# Altium project sonar.PrjPcb
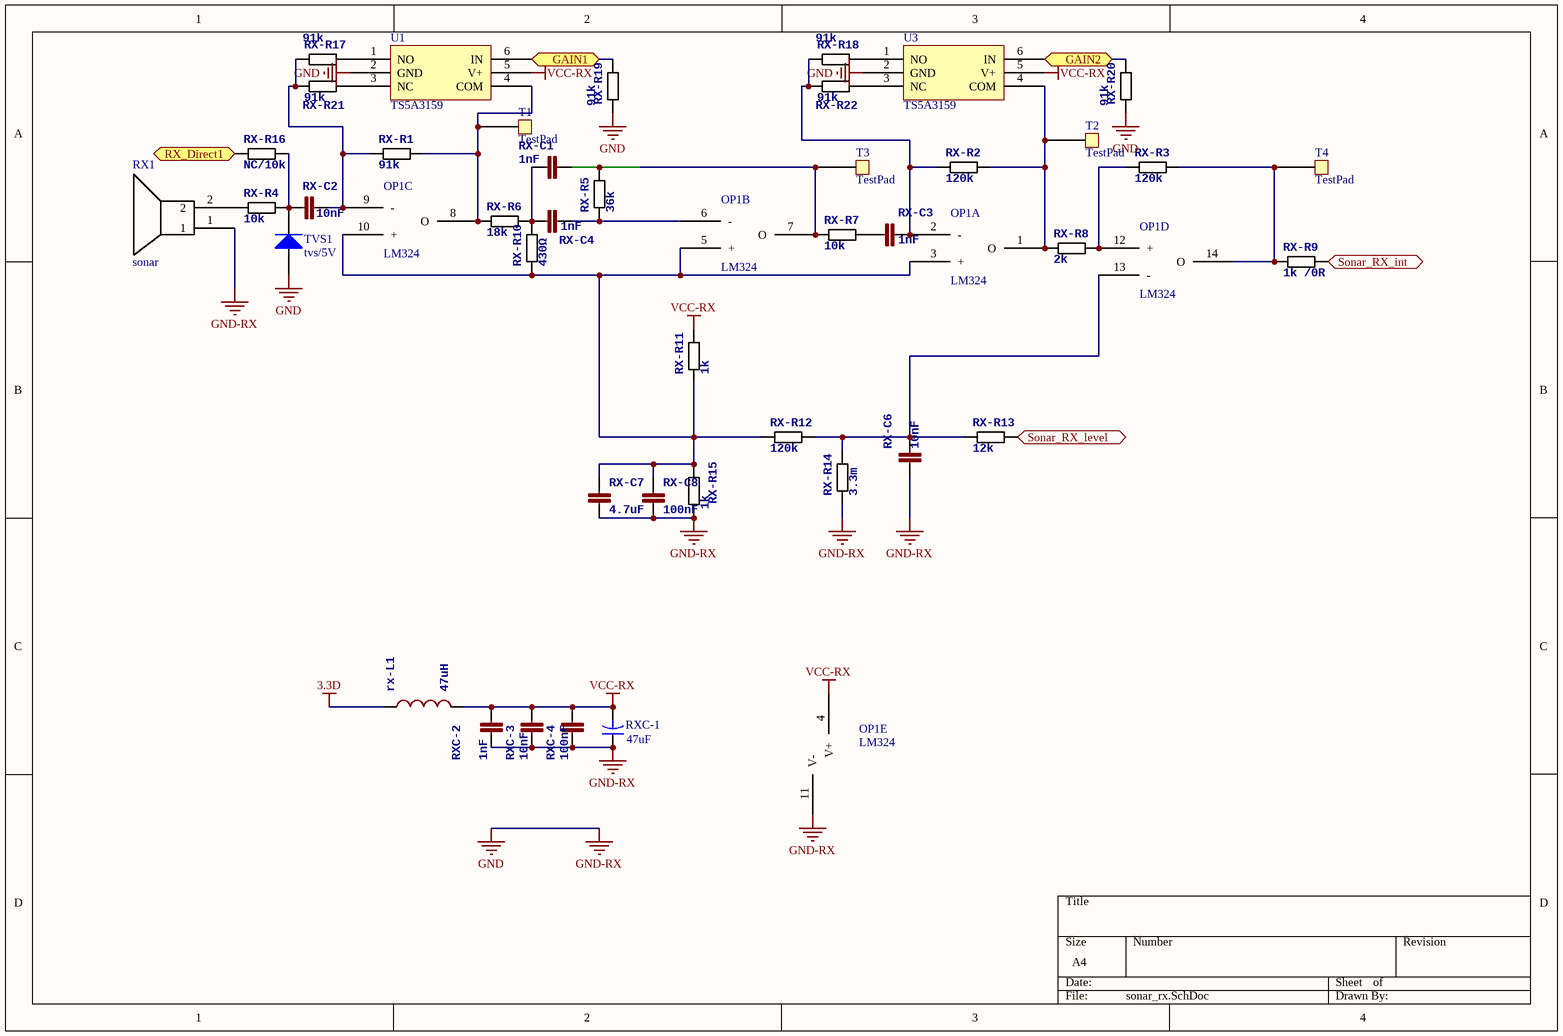
[diagram p0: sonar_rx.SchDoc]
3 sheets, 83 parts. Net scope: flat (ports and power ports of the same name join across sheets).
Board file: sonar_test.PcbDoc
Sheets:
  sonar_rx.SchDoc
  MCU.SchDoc
  sonar_tx.SchDoc

## Sheet sonar_rx.SchDoc
size A4

### Parts
OP1  LM324  (parts A,B,C,D,E of 5)
RX1  sonar  [sonar-16mm]
RX-C1  1nF  [0402]
RX-C2  10nF  [0402]
RX-C3  1nF  [0402]
RX-C4  1nF  [0402]
RX-C6  10nF  [0402]
RX-C7  4.7uF  [0402]
RX-C8  100nF  [0402]
rx-L1  47uH  [0805-IND]
RX-R1  91k  [0402]
RX-R2  120k  [0402]
RX-R3  120k  [0402]
RX-R4  10k  [0402]
RX-R5  36k  [0402]
RX-R6  18k  [0402]
RX-R7  10k  [0402]
RX-R8  2k  [0402]
RX-R9  1k /0R  [0402]
RX-R10  430Ω  [0402]
RX-R11  1k  [0402]
RX-R12  120k  [0402]
RX-R13  12k  [0402]
RX-R14  3.3m  [0402]
RX-R15  1k  [0402]
RX-R16  NC/10k  [0402]
RX-R17  91k  [0402]
RX-R18  91k  [0402]
RX-R19  91k  [0402]
RX-R20  91k  [0402]
RX-R21  91k  [0402]
RX-R22  91k  [0402]
RXC-1  47uF  [C0805]
RXC-2  1nF  [0402]
RXC-3  10nF  [0402]
RXC-4  100nF  [0402]
T1  TestPad  [TestPad - 1mm]
T2  TestPad  [TestPad - 1mm]
T3  TestPad  [TestPad - 1mm]
T4  TestPad  [TestPad - 1mm]
TVS1  tvs/5V  [0805]
U1  TS5A3159  [SOT23-6]
U3  TS5A3159  [SOT23-6]

### Ports
GAIN1, GAIN2, RX_Direct1, Sonar_RX_int, Sonar_RX_level

### Nets
3.3D: rx-L1.1
GND: OP1.11(V-) RX1.1 RX-C6.1 RX-C7.2 RX-C8.2 RX-R14.1 RX-R15.1 RX-R19.1 RX-R20.1 RXC-1.1 RXC-2.1 RXC-3.1 RXC-4.1 TVS1.1(A) U1.2(GND) U3.2(GND)  [also labelled GND-RX]
VCC-RX: OP1.4(V+) rx-L1.2 RX-R11.2 RXC-1.2 RXC-2.2 RXC-3.2 RXC-4.2 U1.5(V+) U3.5(V+)
NetC7_1: RX-R16.1 ; port RX_Direct1
Netmcu1_7: RX-R9.2 ; port Sonar_RX_int
Netmcu1_8: RX-R13.2 ; port Sonar_RX_level
Netmcu1_23: RX-R19.2 U1.6(IN) ; port GAIN1
Netmcu1_24: RX-R20.2 U3.6(IN) ; port GAIN2
NetOP1_1: OP1.1(O) RX-R2.2 RX-R8.1 T2.1 U3.4(COM)
NetOP1_2: OP1.2(-) RX-C3.2 RX-R2.1 RX-R18.1 RX-R22.1
NetOP1_3: OP1.3(+) OP1.5(+) OP1.10(+) RX-C7.1 RX-C8.1 RX-R10.1 RX-R11.1 RX-R12.1 RX-R15.2
NetOP1_6: OP1.6(-) RX-C4.2 RX-R5.1
NetOP1_7: OP1.7(O) RX-C1.2 RX-R5.2 RX-R7.1 T3.1
NetOP1_8: OP1.8(O) RX-R1.2 RX-R6.1 T1.1 U1.4(COM)
NetOP1_9: OP1.9(-) RX-C2.2 RX-R1.1 RX-R17.1 RX-R21.1
NetOP1_12: OP1.12(+) RX-R3.1 RX-R8.2
NetOP1_13: OP1.13(-) RX-C6.2 RX-R12.2 RX-R13.1 RX-R14.2
NetOP1_14: OP1.14(O) RX-R3.2 RX-R9.1 T4.1
NetRX1_2: RX1.2 RX-R4.1
NetRX-C1_1: RX-C1.1 RX-C4.1 RX-R6.2 RX-R10.2
NetRX-C2_1: RX-C2.1 RX-R4.2 RX-R16.2 TVS1.2(K)
NetRX-C3_1: RX-C3.1 RX-R7.2
NetRX-R17_2: RX-R17.2 U1.1(NO)
NetRX-R18_2: RX-R18.2 U3.1(NO)
NetRX-R21_2: RX-R21.2 U1.3(NC)
NetRX-R22_2: RX-R22.2 U3.3(NC)

### Library data of the parts
OP1 = OP-SOP14
RX-C1-RX-C4 RX-C6 RXC-2-RXC-4 = CAP0603H: <b>Capacitor</b> / Standard 0603 ceramic capacitor, and 0.1" leaded capacitor.; PARTNO: CC0603ZRY5V7BB105
RX-C7 RX-C8 = CAP0603: <b>Capacitor</b> / Standard 0603 ceramic capacitor, and 0.1" leaded capacitor.; PARTNO: CC0603ZRY5V7BB105
rx-L1 = INDUCTOR0805: <b>Inductors</b> / Basic Inductor/Choke - 0603 and 1210. Footprints are not proven and vary greatly between part numbers. / SRR1210: Bourns SRR1210 parts, e.g. SRR1210-100M; PARTNO: MLZ2012M470W
RX-R1-RX-R22 = RESISTOR0603B: <b>Resistor</b> / Basic schematic elements and footprints for 0603, 1206, and PTH 1/10th watt (small) resistors.; PARTNO: RMCF0402FT453K
RXC-1 = Cap2: Capacitor; Published: 23-Sep-2002; PackageReference: CAPR5-4X5; Publisher: Altium Limited; PackageDescription: Capacitor; 2 Leads; Value: 47uF
TVS1 = Diode: Default Diode; Published: 8-Jun-2000; LatestRevisionDate: 17-Jul-2002; LatestRevisionNote: Re-released for DXP Platform.; PackageVersion: Sep-1996; PackageReference: SMC; Publisher: Altium Limited; PackageDescription: DO-214-AB/SMC; 2 C-Bend Leads; Body 7.9 x 5.9 mm, inc. leads (LxW); Code_JEDEC: DO-214-AB

## Sheet MCU.SchDoc
size A4
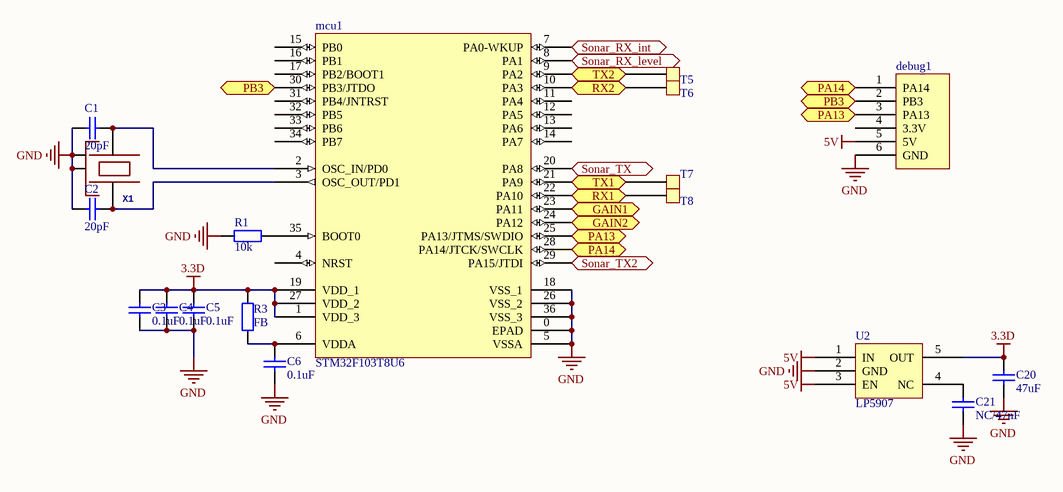
[diagram p1: MCU.SchDoc]

### Parts
C1  value 20pF  [0402]  (hidden comment: Cap)
C2  value 20pF  [0402]  (hidden comment: Cap)
C3  value 0.1uF  [0402]  (hidden comment: Cap)
C4  value 0.1uF  [0402]  (hidden comment: Cap)
C5  value 0.1uF  [0402]  (hidden comment: Cap)
C6  value 0.1uF  [0402]  (hidden comment: Cap)
C20  value 47uF  [0805]  (hidden comment: Cap)
C21  value NC/47nF  [0402]  (hidden comment: Cap)
debug1  debug  [WFRSM125]  (value not drawn)
mcu1  STM32F103T8U6  [VFQN36_N]
R1  value 10k  [0402]  (hidden comment: Res2)
R3  value FB  [0402]  (hidden comment: Res2)
T5  TestPad  [TestPad - 1mm]  (value not drawn)
T6  TestPad  [TestPad - 1mm]  (value not drawn)
T7  TestPad  [TestPad - 1mm]  (value not drawn)
T8  TestPad  [TestPad - 1mm]  (value not drawn)
U2  LP5907  [SOT23-5]
X1  24.000 KHz 3.2x2.5mm 8-10pf  [OSCILLATOR-3.2X2.5]  (value not drawn)

### Ports
GAIN1, GAIN2, PA13, PA14, PB3, RX1, RX2, Sonar_RX_int, Sonar_RX_level, Sonar_TX, Sonar_TX2, TX1, TX2

### Nets
3.3D: C3.2 C4.2 C5.2 C20.1 mcu1.1(VDD_3) mcu1.19(VDD_1) mcu1.27(VDD_2) R3.1 U2.5(OUT)
5V: debug1.5(5V) U2.1(IN) U2.3(EN)
GND: C1.1 C2.1 C3.1 C4.1 C5.1 C6.1 C20.2 C21.2 debug1.6(GND) mcu1.0(EPAD) mcu1.5(VSSA) mcu1.18(VSS_1) mcu1.26(VSS_2) mcu1.36(VSS_3) R1.2 U2.2(GND) X1.2(NC_2) X1.4(NC_4)
NetC1_2: C1.2 mcu1.2(OSC_IN/PD0) X1.1
NetC2_2: C2.2 mcu1.3(OSC_OUT/PD1) X1.3
NetC6_2: C6.2 mcu1.6(VDDA) R3.2
NetC21_1: C21.1 U2.4(NC)
Netdebug1_1: debug1.1(PA14) mcu1.28(PA14/JTCK/SWCLK) ; port PA14
Netdebug1_2: debug1.2(PB3) mcu1.30(PB3/JTDO) ; port PB3
Netdebug1_3: debug1.3(PA13) mcu1.25(PA13/JTMS/SWDIO) ; port PA13
Netmcu1_7: mcu1.7(PA0-WKUP) ; port Sonar_RX_int
Netmcu1_8: mcu1.8(PA1) ; port Sonar_RX_level
Netmcu1_9: mcu1.9(PA2) T5.1 ; port TX2
Netmcu1_10: mcu1.10(PA3) T6.1 ; port RX2
Netmcu1_20: mcu1.20(PA8) ; port Sonar_TX
Netmcu1_21: mcu1.21(PA9) T7.1 ; port TX1
Netmcu1_22: mcu1.22(PA10) T8.1 ; port RX1
Netmcu1_23: mcu1.23(PA11) ; port GAIN1
Netmcu1_24: mcu1.24(PA12) ; port GAIN2
Netmcu1_29: mcu1.29(PA15/JTDI) ; port Sonar_TX2
Netmcu1_35: mcu1.35(BOOT0) R1.1

Not connected (* = marked no-connect by the designer): debug1 4(3.3V); mcu1 4(NRST) 11(PA4) 12(PA5) 13(PA6) 14(PA7) 15(PB0) 16(PB1) 17(PB2/BOOT1) 31(PB4/JNTRST) 32(PB5) 33(PB6) 34(PB7)

### Library data of the parts
C1-C6 C20 C21 = Cap: Capacitor; Published: 8-Jun-2000; LatestRevisionDate: 17-Jul-2002; LatestRevisionNote: Re-released for DXP Platform.; PackageReference: RAD-0.3; Publisher: Altium Limited; PackageDescription: Radial Cap, Thru-Hole; 2 Leads; 0.3 in Pin Spacing
mcu1 = STM32F103T8U6: STM32 ARM-based 32-bit MCU with 64 Kbytes Flash, 36-pin VFQFPN, Industrial Temperature; Published: *; DatasheetVersion: *; PackageVersion: *; PackageReference: *; Publisher: *; PackageDescription: *; ComponentLink1Description: *; ComponentLink1URL: *; ComponentLink2Description: *; ComponentLink2URL: *
R1 R3 = Res2: Resistor; Published: 8-Jun-2000; LatestRevisionDate: 17-Jul-2002; LatestRevisionNote: Re-released for DXP Platform.; PackageReference: AXIAL-0.4; Publisher: Altium Limited; PackageDescription: Axial Device, Thru-Hole; 2 Leads; 0.4 in Pin Spacing
X1 = OSCILLATOR-3.2X2.5: Crystal Oscillator in 3.2x2.5 SMD

## Sheet sonar_tx.SchDoc
size A4
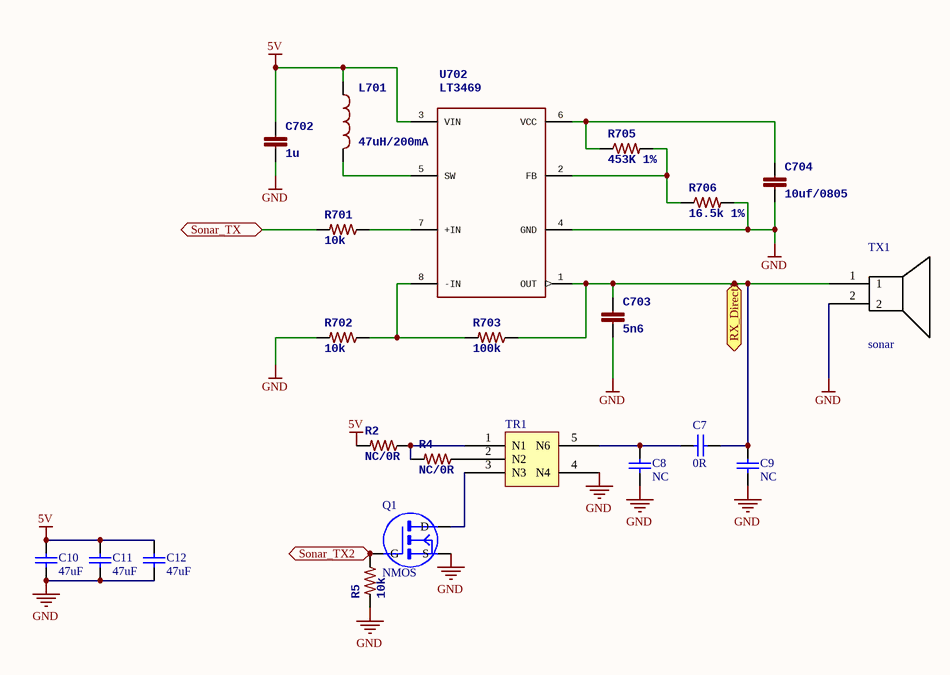
[diagram p2: sonar_tx.SchDoc]

### Parts
C7  value 0R  [0805]  (hidden comment: Cap)
C8  value NC  [0805]  (hidden comment: Cap)
C9  value NC  [0805]  (hidden comment: Cap)
C10  value 47uF  [0805]  (hidden comment: Cap)
C11  value 47uF  [0805]  (hidden comment: Cap)
C12  value 47uF  [0805]  (hidden comment: Cap)
C702  1u  [0402]
C703  5n6  [0402]
C704  10uf/0805  [0805]
L701  47uH/200mA  [0805-IND]
Q1  NMOS  [SOT23_L]
R2  NC/0R  [0402]
R4  NC/0R  [0402]
R5  10k  [0402]
R701  10k  [0402]
R702  10k  [0402]
R703  100k  [0402]
R705  453K 1%  [0402]
R706  16.5k 1%  [0402]
TR1  Transformer_B78416A2232A003  [Transformer_B78416A2232A003]  (value not drawn)
TX1  sonar  [sonar-16mm]
U702  LT3469  [SOT23-8]

### Ports
RX_Direct1, Sonar_TX, Sonar_TX2

### Nets
5V: C10.1 C11.1 C12.1 C702.1 L701.1 R2.2 U702.3(VIN)
GND: C8.2 C9.2 C10.2 C11.2 C12.2 C702.2 C703.2 C704.2 Q1.S R5.2 R702.2 R706.2 TR1.4(N4) TX1.2 U702.4(GND)
NetC7_1: C7.1 C9.1 C703.1 R703.1 TX1.1 U702.1(OUT) ; port RX_Direct1
NetC7_2: C7.2 C8.1 TR1.5(N6)
NetC704_1: C704.1 R705.1 U702.6(VCC)
NetL701_2: L701.2 U702.5(SW)
Netmcu1_20: R701.2 ; port Sonar_TX
Netmcu1_29: Q1.G R5.1 ; port Sonar_TX2
NetQ1_D: Q1.D TR1.3(N3)
NetR2_1: R2.1 R4.2 TR1.1(N1)
NetR4_1: R4.1 TR1.2(N2)
NetR701_1: R701.1 U702.7(+IN)
NetR702_1: R702.1 R703.2 U702.8(-IN)
NetR705_2: R705.2 R706.1 U702.2(FB)

### Library data of the parts
C7-C12 = Cap: Capacitor; Published: 8-Jun-2000; LatestRevisionDate: 17-Jul-2002; LatestRevisionNote: Re-released for DXP Platform.; PackageReference: RAD-0.3; Publisher: Altium Limited; PackageDescription: Radial Cap, Thru-Hole; 2 Leads; 0.3 in Pin Spacing
C702 = CAP0603: as RX-C7 on sheet sonar_rx
C703 = CAP0402: <b>Capacitor</b> / Standard 0603 ceramic capacitor, and 0.1" leaded capacitor.; PARTNO: C0402C562K5RACTU
C704 = CAP0402: <b>Capacitor</b> / Standard 0603 ceramic capacitor, and 0.1" leaded capacitor.; PARTNO: C1005X5R1C474K050BC
L701 = INDUCTOR0805: as rx-L1 on sheet sonar_rx
Q1 = NMOS: pin to pad: D>1 G>3 S>2
R2 R4 R5 R701-R703 R705 R706 = RESISTOR0402-RES: <b>Resistor</b> / Basic schematic elements and footprints for 0603, 1206, and PTH 1/10th watt (small) resistors.; PARTNO: RMCF0402FT453K
U702 = LT3469: LT3469 Piezo microactuator driver with boost regulator; PARTNO: LT3469ETS8

## Nets that join several sheets
3.3D: sonar_rx (rx-L1.1), MCU (9 pins)
5V: MCU (debug1.5 U2.1 U2.3), sonar_tx (7 pins)
GND: sonar_rx (16 pins), MCU (18 pins), sonar_tx (15 pins)
NetC7_1: sonar_rx (RX-R16.1), sonar_tx (6 pins)
Netmcu1_7: sonar_rx (RX-R9.2), MCU (mcu1.7)
Netmcu1_8: sonar_rx (RX-R13.2), MCU (mcu1.8)
Netmcu1_20: MCU (mcu1.20), sonar_tx (R701.2)
Netmcu1_23: sonar_rx (RX-R19.2 U1.6), MCU (mcu1.23)
Netmcu1_24: sonar_rx (RX-R20.2 U3.6), MCU (mcu1.24)
Netmcu1_29: MCU (mcu1.29), sonar_tx (Q1.G R5.1)